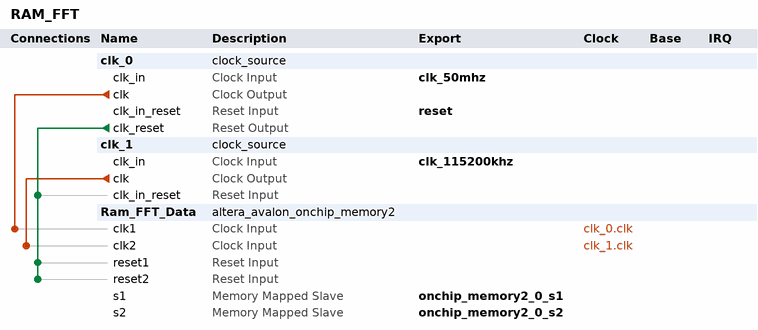
[diagram p0: system contents]
# Platform Designer (Qsys) system RAM_FFT, Cyclone V 5CGXFC5C6F27C7
# Parameters at their usual value, and those the tool derives, are not listed.
package require -exact qsys 17.0
create_system RAM_FFT
set_project_property DEVICE_FAMILY {Cyclone V}
set_project_property DEVICE 5CGXFC5C6F27C7

add_instance clk_0 clock_source 17.0
set_instance_parameter_value clk_0 clockFrequency 50000000

add_instance clk_1 clock_source 17.0
set_instance_parameter_value clk_1 clockFrequency 115200

add_instance Ram_FFT_Data altera_avalon_onchip_memory2 17.0
set_instance_parameter_value Ram_FFT_Data dataWidth 32
set_instance_parameter_value Ram_FFT_Data dualPort true
set_instance_parameter_value Ram_FFT_Data initMemContent true
set_instance_parameter_value Ram_FFT_Data initializationFileName onchip_mem.hex
set_instance_parameter_value Ram_FFT_Data memorySize 8192

# connections
add_connection clk_0.clk Ram_FFT_Data.clk1 clock
add_connection clk_1.clk Ram_FFT_Data.clk2 clock
add_connection clk_0.clk_reset clk_1.clk_in_reset reset
add_connection clk_0.clk_reset Ram_FFT_Data.reset1 reset
add_connection clk_0.clk_reset Ram_FFT_Data.reset2 reset

# exported interfaces
add_interface clk_115200khz clock sink
set_interface_property clk_115200khz EXPORT_OF clk_1.clk_in
add_interface clk_50mhz clock sink
set_interface_property clk_50mhz EXPORT_OF clk_0.clk_in
add_interface onchip_memory2_0_s1 avalon slave
set_interface_property onchip_memory2_0_s1 EXPORT_OF Ram_FFT_Data.s1
add_interface onchip_memory2_0_s2 avalon slave
set_interface_property onchip_memory2_0_s2 EXPORT_OF Ram_FFT_Data.s2
add_interface reset reset sink
set_interface_property reset EXPORT_OF clk_0.clk_in_reset

set_interconnect_requirement {$system} qsys_mm.clockCrossingAdapter HANDSHAKE
set_interconnect_requirement {$system} qsys_mm.enableEccProtection FALSE
set_interconnect_requirement {$system} qsys_mm.insertDefaultSlave FALSE
set_interconnect_requirement {$system} qsys_mm.maxAdditionalLatency 1

save_system RAM_FFT.qsys
